# Altium schematic sheet cybathlon_core.SchDoc
size A2; SheetNumber: 1; SheetTotal: 1
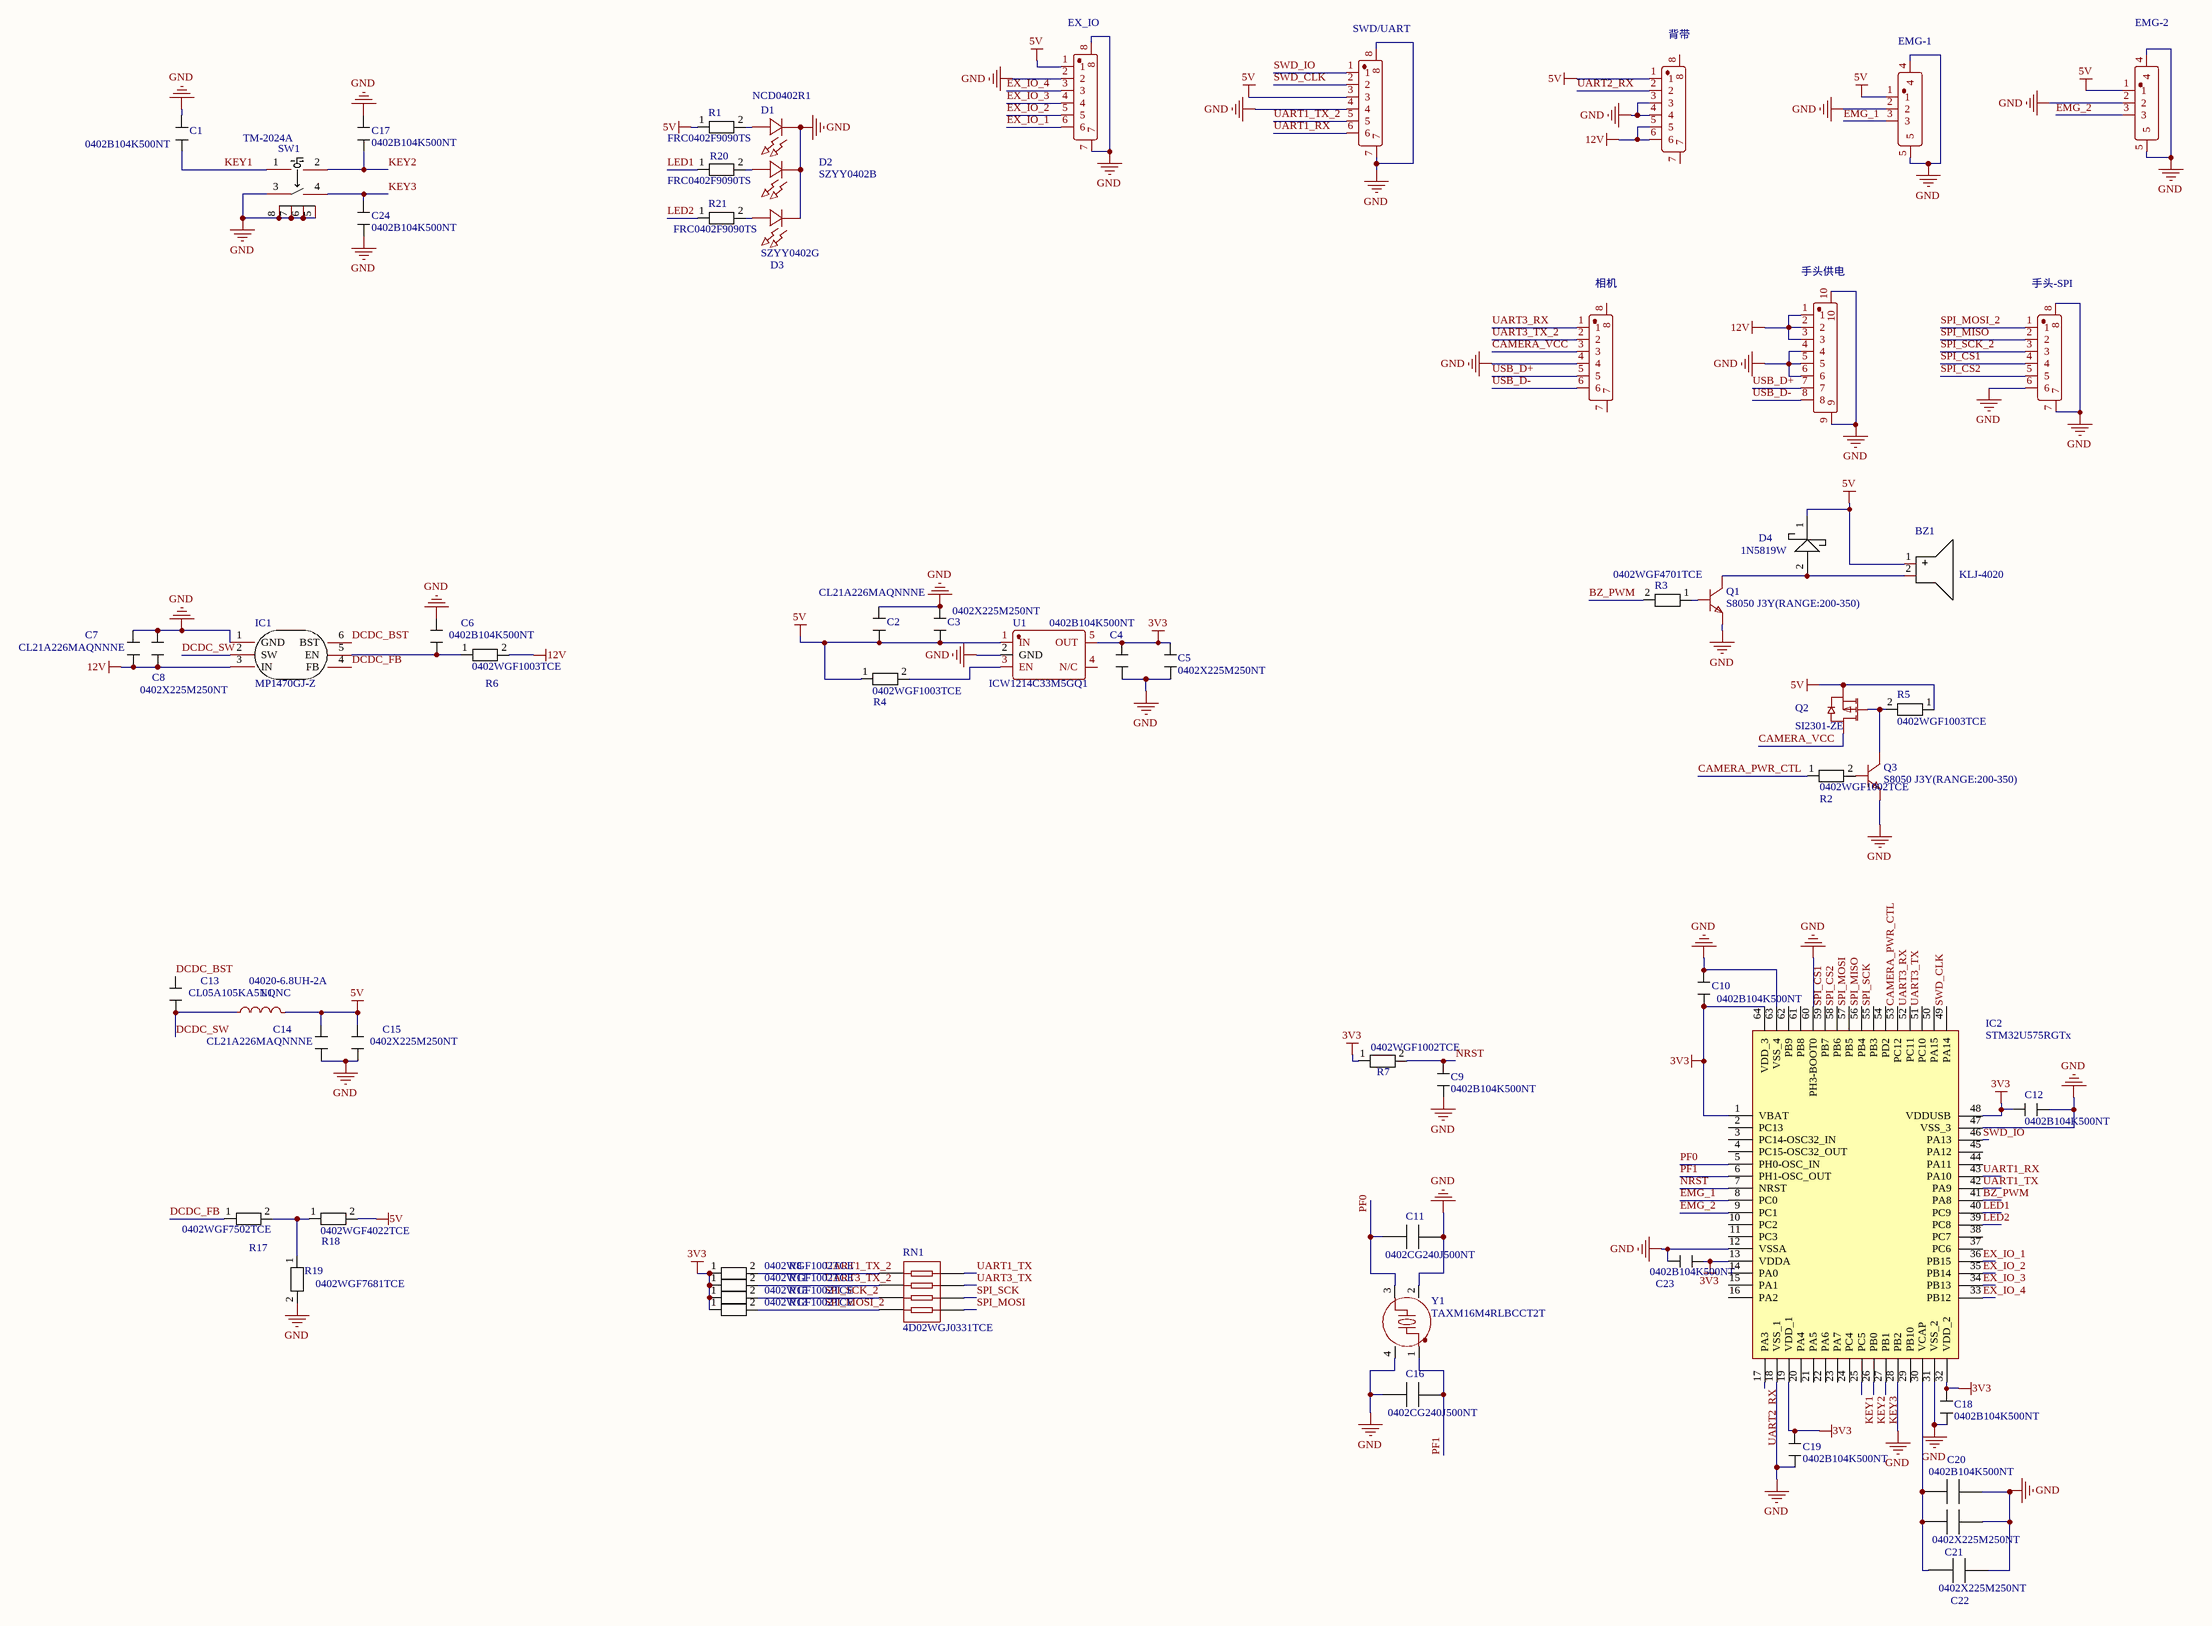
[diagram p0: cybathlon_core.SchDoc]

## Parts
BZ1  KLJ-4020  [BUZ-SMD_L4.0-W4.0-P3.50-L]
C1  0402B104K500NT  [CAP_0402]
C2  CL21A226MAQNNNE  [CAP_0805]
C3  0402X225M250NT  [CAP_0402]
C4  0402B104K500NT  [CAP_0402]
C5  0402X225M250NT  [CAP_0402]
C6  0402B104K500NT  [CAP_0402]
C7  CL21A226MAQNNNE  [CAP_0805]
C8  0402X225M250NT  [CAP_0402]
C9  0402B104K500NT  [CAP_0402]
C10  0402B104K500NT  [CAP_0402]
C11  0402CG240J500NT  [CAP_0402]
C12  0402B104K500NT  [CAP_0402]
C13  CL05A105KA5NQNC  [CAP_0402]
C14  CL21A226MAQNNNE  [CAP_0805]
C15  0402X225M250NT  [CAP_0402]
C16  0402CG240J500NT  [CAP_0402]
C17  0402B104K500NT  [CAP_0402]
C18  0402B104K500NT  [CAP_0402]
C19  0402B104K500NT  [CAP_0402]
C20  0402B104K500NT  [CAP_0402]
C21  0402X225M250NT  [CAP_0402]
C22  0402X225M250NT  [CAP_0402]
C23  0402B104K500NT  [CAP_0402]
C24  0402B104K500NT  [CAP_0402]
D1  NCD0402R1  [LED0603-RD]
D2  SZYY0402B  [LED0603-RD]
D3  SZYY0402G  [LED0603-RD]
D4  1N5819W  [SHOTTKY DIODE_SOD-123]
IC1  MP1470GJ-Z  [SOT-23-6_L2.9-W1.6-P0.95-LS2.8-BR]
IC2  STM32U575RGTx  [STM32U575RGTx]
L1  04020-6.8UH-2A  [L_04020_L4.1_W4.6]
P1  背带  [CONN-SMD_3P-P1.50_1.5-6P-WTDK]
P2  SWD/UART  [CONN-SMD_6P-P1.00_XUNPU_WAFER-SH1.0-6PWB]
P4  EMG-1  [CONN-SMD_3P-P1.0-HC-1.0-3PWT]
P5  EMG-2  [CONN-SMD_3P-P1.0-HC-1.0-3PWT]
P6  EX_IO  [CONN-SMD_6P-P1.00_XUNPU_WAFER-SH1.0-6PWB]
P7  手头供电  [CONN-SMD_8P-P1.00_XUNPU_WAFER-SH1.0-8PWB]
P8  相机  [CONN-SMD_3P-P1.50_1.5-6P-WTDK]
P9  手头-SPI  [CONN-SMD_6P-P1.00_XUNPU_WAFER-SH1.0-6PWB]
Q1  S8050 J3Y(RANGE:200-350)  [SOT-23]
Q2  SI2301-ZE  [SOT-23]
Q3  S8050 J3Y(RANGE:200-350)  [SOT-23]
R1  FRC0402F9090TS  [RES_0402]
R2  0402WGF1002TCE  [RES_0402]
R3  0402WGF4701TCE  [RES_0402]
R4  0402WGF1003TCE  [RES_0402]
R5  0402WGF1003TCE  [RES_0402]
R6  0402WGF1003TCE  [RES_0402]
R7  0402WGF1002TCE  [RES_0402]
R8  0402WGF1002TCE  [RES_0402]
R11  0402WGF1002TCE  [RES_0402]
R13  0402WGF1002TCE  [RES_0402]
R15  0402WGF1002TCE  [RES_0402]
R17  0402WGF7502TCE  [RES_0402]
R18  0402WGF4022TCE  [RES_0402]
R19  0402WGF7681TCE  [RES_0402]
R20  FRC0402F9090TS  [RES_0402]
R21  FRC0402F9090TS  [RES_0402]
RN1  4D02WGJ0331TCE  [RES_0402_4P]
SW1  TM-2024A  [SW-SMD_TM-2024A]
U1  ICW1214C33M5GQ1  [SOT-23-5_L3.0-W1.7-P0.95-LS2.8-BL]
Y1  TAXM16M4RLBCCT2T  [OSC_3225]

## Nets
3V3: C4.1 C5.1 C10.2 C12.2 C18.2 C19.2 C23.2 IC2.1(VBAT) IC2.13(VDDA) IC2.19(VDD_1) IC2.32(VDD_2) IC2.48(VDDUSB) IC2.64(VDD_3) R7.1 R8.1 R11.1 R13.1 R15.1 U1.5(OUT)
5V: BZ1.1(+) C2.2 C3.2 C14.1 C15.1 D4.1 L1.2 P1.1 P2.3 P4.1 P5.1 P6.1 Q2.2(S) R1.1 R4.1 R5.1 R18.2 U1.1(IN)
12V: C7.2 C8.2 IC1.3(IN) P1.5 P1.6 P7.1 P7.2 P7.3 R6.2
GND: C1.2 C2.1 C3.1 C4.2 C5.2 C6.1 C7.1 C8.1 C9.1 C10.1 C11.1 C12.1 C14.2 C15.2 C16.2 C17.2 C18.1 C19.1 C20.2 C21.2 C22.2 C23.1 C24.1 D1.2(-) D2.2(-) D3.2(-) IC1.1(GND) IC2.12(VSSA) IC2.18(VSS_1) IC2.28(PB2) IC2.31(VSS_2) IC2.47(VSS_3) IC2.60(PH3-BOOT0) IC2.63(VSS_4) P1.3 P1.4 P2.4 P2.7 P2.8 P4.2 P4.4 P4.5 P5.2 P5.4 P5.5 P6.2 P6.7 P6.8 P7.4 P7.5 P7.6 P7.9 P7.10 P8.4 P9.6 P9.7 P9.8 Q1.2(E) Q3.2(E) R19.2 SW1.3 SW1.5 SW1.6 SW1.7 SW1.8 U1.2(GND) Y1.2(GND) Y1.4(GND)
BZ_PWM: IC2.41(PA8) R3.2
CAMERA_PWR_CTL: IC2.53(PC12) R2.1
CAMERA_VCC: P8.3 Q2.3(D)
DCDC_BST: C13.1 IC1.6(BST)
DCDC_FB: IC1.4(FB) R17.1
DCDC_SW: C13.2 IC1.2(SW) L1.1
EMG_1: IC2.8(PC0) P4.3
EMG_2: IC2.9(PC1) P5.3
EX_IO_1: IC2.36(PB15) P6.6
EX_IO_2: IC2.35(PB14) P6.5
EX_IO_3: IC2.34(PB13) P6.4
EX_IO_4: IC2.33(PB12) P6.3
KEY1: C1.1 IC2.25(PC5) SW1.1
KEY2: C17.1 IC2.26(PB0) SW1.2
KEY3: C24.2 IC2.27(PB1) SW1.4
LED1: IC2.40(PC9) R20.1
LED2: IC2.39(PC8) R21.1
NRST: C9.2 IC2.7(NRST) R7.2
PF0: C11.2 IC2.5(PH0-OSC_IN) Y1.3
PF1: C16.1 IC2.6(PH1-OSC_OUT) Y1.1
SPI_CS1: IC2.59(PB7) P9.4
SPI_CS2: IC2.58(PB6) P9.5
SPI_MISO: IC2.56(PB4) P9.2
SPI_MOSI: IC2.57(PB5) RN1.5
SPI_MOSI_2: P9.1 R13.2 RN1.4
SPI_SCK: IC2.55(PB3) RN1.6
SPI_SCK_2: P9.3 R15.2 RN1.3
SWD_CLK: IC2.49(PA14) P2.2
SWD_IO: IC2.46(PA13) P2.1
UART1_RX: IC2.43(PA10) P2.6
UART1_TX: IC2.42(PA9) RN1.8
UART1_TX_2: P2.5 R8.2 RN1.1
UART2_RX: IC2.17(PA3) P1.2
UART3_RX: IC2.52(PC11) P8.1
UART3_TX: IC2.51(PC10) RN1.7
UART3_TX_2: P8.2 R11.2 RN1.2
USB_D+: P7.7 P8.5
USB_D-: P7.8 P8.6
NetBZ1_2: BZ1.2(-) D4.2 Q1.3(C)
NetC6_2: C6.2 IC1.5(EN) R6.1
NetC20_1: C20.1 C21.1 C22.1 IC2.30(VCAP)
NetD1_1: D1.1(+) R1.2
NetD2_1: D2.1(+) R20.2
NetD3_1: D3.1(+) R21.2
NetQ1_1: Q1.1(B) R3.1
NetQ2_1: Q2.1(G) Q3.3(C) R5.2
NetQ3_1: Q3.1(B) R2.2
NetR4_2: R4.2 U1.3(EN)
NetR17_2: R17.2 R18.1 R19.1

Not connected (* = marked no-connect by the designer): IC2 2(PC13) 3(PC14-OSC32_IN) 4(PC15-OSC32_OUT) 10(PC2) 11(PC3) 14(PA0) 15(PA1) 16(PA2) 20(PA4) 21(PA5) 22(PA6) 23(PA7) 24(PC4) 29(PB10) 37(PC6) 38(PC7) 44(PA11) 45(PA12) 50(PA15) 54(PD2) 61(PB8) 62(PB9); P1 7 8; P8 7 8; U1 4(N/C)

## Library data of the parts
BZ1 = BUZZER_UNSOURCE
C1-C24 = CAP
D1-D3 = LED
D4 = SHOTTKY DIODE
IC2 = STM32U575RGTx: STM32U575RGT6
L1 = INDUCTANCE
P1 P2 P6 P8 P9 = 6P
P4 P5 = 3P
P7 = 8P
Q1 Q3 = NPN
Q2 = PMOS
R1-R8 R11 R13 R15 R17-R21 = RES
RN1 = RES_4P
SW1 = WHEEL_SWITCH
U1 = SGM2210
Y1 = OSC